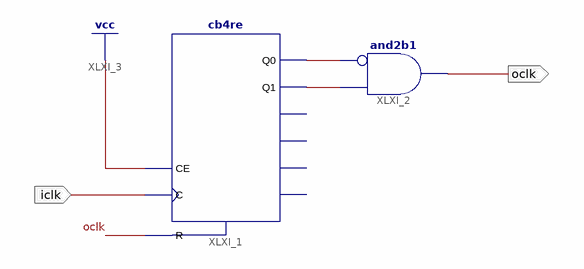
[diagram p0: schematic sheet 1]
// Xilinx ISE schematic fdiv.sch (xc9500) as structural Verilog: 2 symbols, 2 ports
module fdiv (
  input  iclk,
  output oclk
);

  wire XLXN_3, XLXN_4;

  cb4re XLXI_1 (.C(iclk), .CE(1'b1), .R(oclk), .Q0(XLXN_3), .Q1(XLXN_4));  // open: CEO, Q2, Q3, TC
  and XLXI_2 (oclk, ~XLXN_3, XLXN_4);  // and2b1
endmodule
